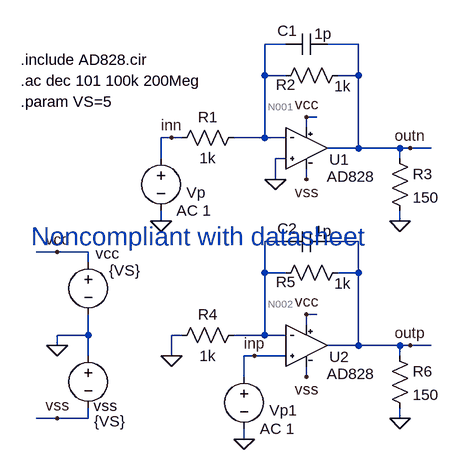
[diagram p0: schematic 04-ad828_active_probe_ac.asc]
04-ad828_active_probe_ac.asc, the LTspice schematic file:
Version 4
SHEET 1 880 680
WIRE 256 -112 224 -112
WIRE 368 -112 320 -112
WIRE 224 -64 224 -112
WIRE 256 -64 224 -64
WIRE 368 -64 368 -112
WIRE 368 -64 336 -64
WIRE 304 0 288 0
WIRE 288 16 288 0
WIRE 80 32 64 32
WIRE 96 32 80 32
WIRE 224 32 224 -64
WIRE 224 32 176 32
WIRE 256 32 224 32
WIRE 368 48 368 -64
WIRE 368 48 320 48
WIRE 432 48 368 48
WIRE 448 48 432 48
WIRE 480 48 448 48
WIRE 64 64 64 32
WIRE 256 64 240 64
WIRE 432 64 432 48
WIRE 240 96 240 64
WIRE 288 96 288 80
WIRE 64 160 64 144
WIRE 432 160 432 144
WIRE 256 192 224 192
WIRE 368 192 320 192
WIRE -96 208 -128 208
WIRE -48 208 -96 208
WIRE -48 224 -48 208
WIRE 224 240 224 192
WIRE 256 240 224 240
WIRE 368 240 368 192
WIRE 368 240 336 240
WIRE 304 304 288 304
WIRE 288 320 288 304
WIRE -48 336 -48 304
WIRE -48 336 -96 336
WIRE 96 336 80 336
WIRE 224 336 224 240
WIRE 224 336 176 336
WIRE 256 336 224 336
WIRE -96 352 -96 336
WIRE 368 352 368 240
WIRE 368 352 320 352
WIRE 432 352 368 352
WIRE 448 352 432 352
WIRE 480 352 448 352
WIRE -48 368 -48 336
WIRE 80 368 80 336
WIRE 208 368 192 368
WIRE 256 368 208 368
WIRE 432 368 432 352
WIRE 192 400 192 368
WIRE 288 400 288 384
WIRE -96 464 -128 464
WIRE -48 464 -48 448
WIRE -48 464 -96 464
WIRE 432 464 432 448
WIRE 192 496 192 480
FLAG -96 352 0
FLAG -96 464 vss
FLAG -96 208 vcc
FLAG 288 0 vcc
FLAG 288 96 vss
FLAG 64 160 0
FLAG 240 96 0
FLAG 432 160 0
FLAG 448 48 outn
FLAG 80 32 inn
FLAG 288 304 vcc
FLAG 288 400 vss
FLAG 192 496 0
FLAG 80 368 0
FLAG 432 464 0
FLAG 448 352 outp
FLAG 208 368 inp
SYMBOL voltage -48 352 R0
WINDOW 0 8 93 Left 2
WINDOW 3 9 117 Left 2
SYMATTR InstName vss
SYMATTR Value {VS}
SYMBOL voltage -48 208 R0
WINDOW 123 0 0 Left 0
WINDOW 39 0 0 Left 0
WINDOW 0 11 2 Left 2
WINDOW 3 32 28 Left 2
SYMATTR InstName vcc
SYMATTR Value {VS}
SYMBOL voltage 64 48 R0
WINDOW 0 39 68 Left 2
SYMATTR InstName Vp
SYMATTR Value AC 1
SYMBOL res 192 16 R90
WINDOW 0 0 56 VBottom 2
WINDOW 3 32 56 VTop 2
SYMATTR InstName R1
SYMATTR Value 1k
SYMBOL res 352 -80 R90
WINDOW 0 46 96 VBottom 2
WINDOW 3 17 8 VTop 2
SYMATTR InstName R2
SYMATTR Value 1k
SYMBOL cap 320 -128 R90
WINDOW 0 11 61 VBottom 2
WINDOW 3 -16 6 VTop 2
SYMATTR InstName C1
SYMATTR Value 1p
SYMBOL res 416 48 R0
SYMATTR InstName R3
SYMATTR Value 150
SYMBOL AD828 288 48 R0
SYMATTR InstName U1
SYMBOL voltage 192 384 R0
WINDOW 0 39 68 Left 2
SYMATTR InstName Vp1
SYMATTR Value AC 1
SYMBOL res 192 320 R90
WINDOW 0 0 56 VBottom 2
WINDOW 3 32 56 VTop 2
SYMATTR InstName R4
SYMATTR Value 1k
SYMBOL res 352 224 R90
WINDOW 0 46 96 VBottom 2
WINDOW 3 17 8 VTop 2
SYMATTR InstName R5
SYMATTR Value 1k
SYMBOL cap 320 176 R90
WINDOW 0 11 61 VBottom 2
WINDOW 3 -16 6 VTop 2
SYMATTR InstName C2
SYMATTR Value 1p
SYMBOL res 416 352 R0
SYMATTR InstName R6
SYMATTR Value 150
SYMBOL AD828 288 352 R0
SYMATTR InstName U2
TEXT -152 -88 Left 2 !.include AD828.cir
TEXT -152 -56 Left 2 !.ac dec 101 100k 200Meg
TEXT -152 -24 Left 2 !.param VS=5
TEXT -136 184 Left 4 ;Noncompliant with datasheet

The netlist it stands for:
* 04-ad828_active_probe_ac.asc
vss 0 vss {VS}
vcc vcc 0 {VS}
Vp inn 0 AC 1
R1 N001 inn 1k
R2 outn N001 1k
C1 outn N001 1p
R3 outn 0 150
XU1 0 N001 vcc vss outn AD828  ; pins 2 1 99 50 46
Vp1 inp 0 AC 1
R4 N002 0 1k
R5 outp N002 1k
C2 outp N002 1p
R6 outp 0 150
XU2 inp N002 vcc vss outp AD828  ; pins 2 1 99 50 46
.include AD828.cir
.ac dec 101 100k 200Meg
.param VS=5
* Noncompliant with datasheet
.lib ad828.cir
.backanno
.end

* Results of the author's LTspice run, read from the files saved beside the schematic
* Operating Point, zero values left out:
*   V(vss) = -5 V
*   V(vcc) = 5 V
*   V(n001) = 499.5 µV
*   V(outn) = 4.274 mV
*   V(n002) = 499.5 µV
*   V(outp) = 4.274 mV
*   I(R1) = 499.5 nA
*   I(R2) = 3.774 µA
*   I(R3) = 28.49 µA
*   I(R4) = 499.5 nA
*   I(R5) = 3.774 µA
*   I(R6) = 28.49 µA
*   I(Vss) = -13.69 mA
*   I(Vcc) = -13.75 mA
*   I(Vp) = 499.5 nA
*   I(Vp1) = -3.325 µA
*   Ix(u1:2) = 3.325 µA
*   Ix(u1:1) = 3.275 µA
*   Ix(u1:99) = 6.873 mA
*   Ix(u1:50) = -6.847 mA
*   Ix(u1:46) = -32.27 µA
*   Ix(u2:2) = 3.325 µA
*   Ix(u2:1) = 3.275 µA
*   Ix(u2:99) = 6.873 mA
*   Ix(u2:50) = -6.847 mA
*   Ix(u2:46) = -32.27 µA
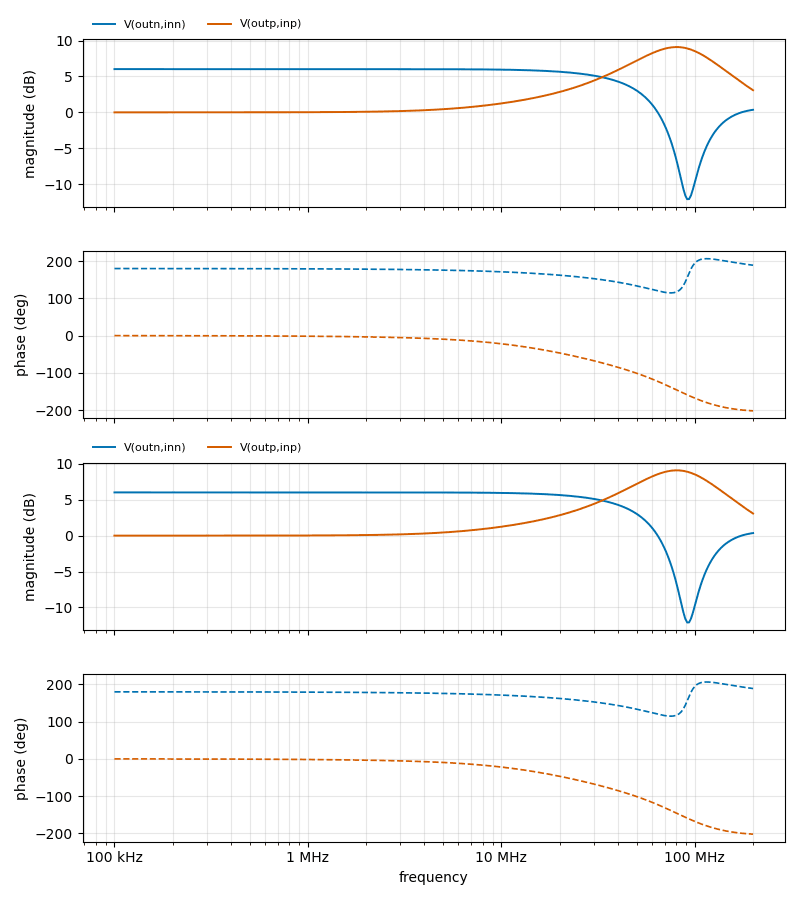
[diagram p1: AC Analysis of 04-ad828_active_probe_ac.asc, plotted from the saved traces]
* AC Analysis, 1 run:
*   V(outn,inn): 6.02 dB at 100 kHz, 0.35 dB at 200 MHz, peak 6.02 dB at 100 kHz, 3 dB below the peak at 50.18 MHz
*   V(outp,inp): -0.00 dB at 100 kHz, 3.08 dB at 200 MHz, peak 9.09 dB at 81.45 MHz, 3 dB below the peak at 41.37 MHz and 139.4 MHz
*   V(outn,inn): 6.02 dB at 100 kHz, 0.35 dB at 200 MHz, peak 6.02 dB at 100 kHz, 3 dB below the peak at 50.18 MHz
*   V(outp,inp): -0.00 dB at 100 kHz, 3.08 dB at 200 MHz, peak 9.09 dB at 81.45 MHz, 3 dB below the peak at 41.37 MHz and 139.4 MHz